# Altium schematic sheet I2C Multiplexer.SchDoc
size A3
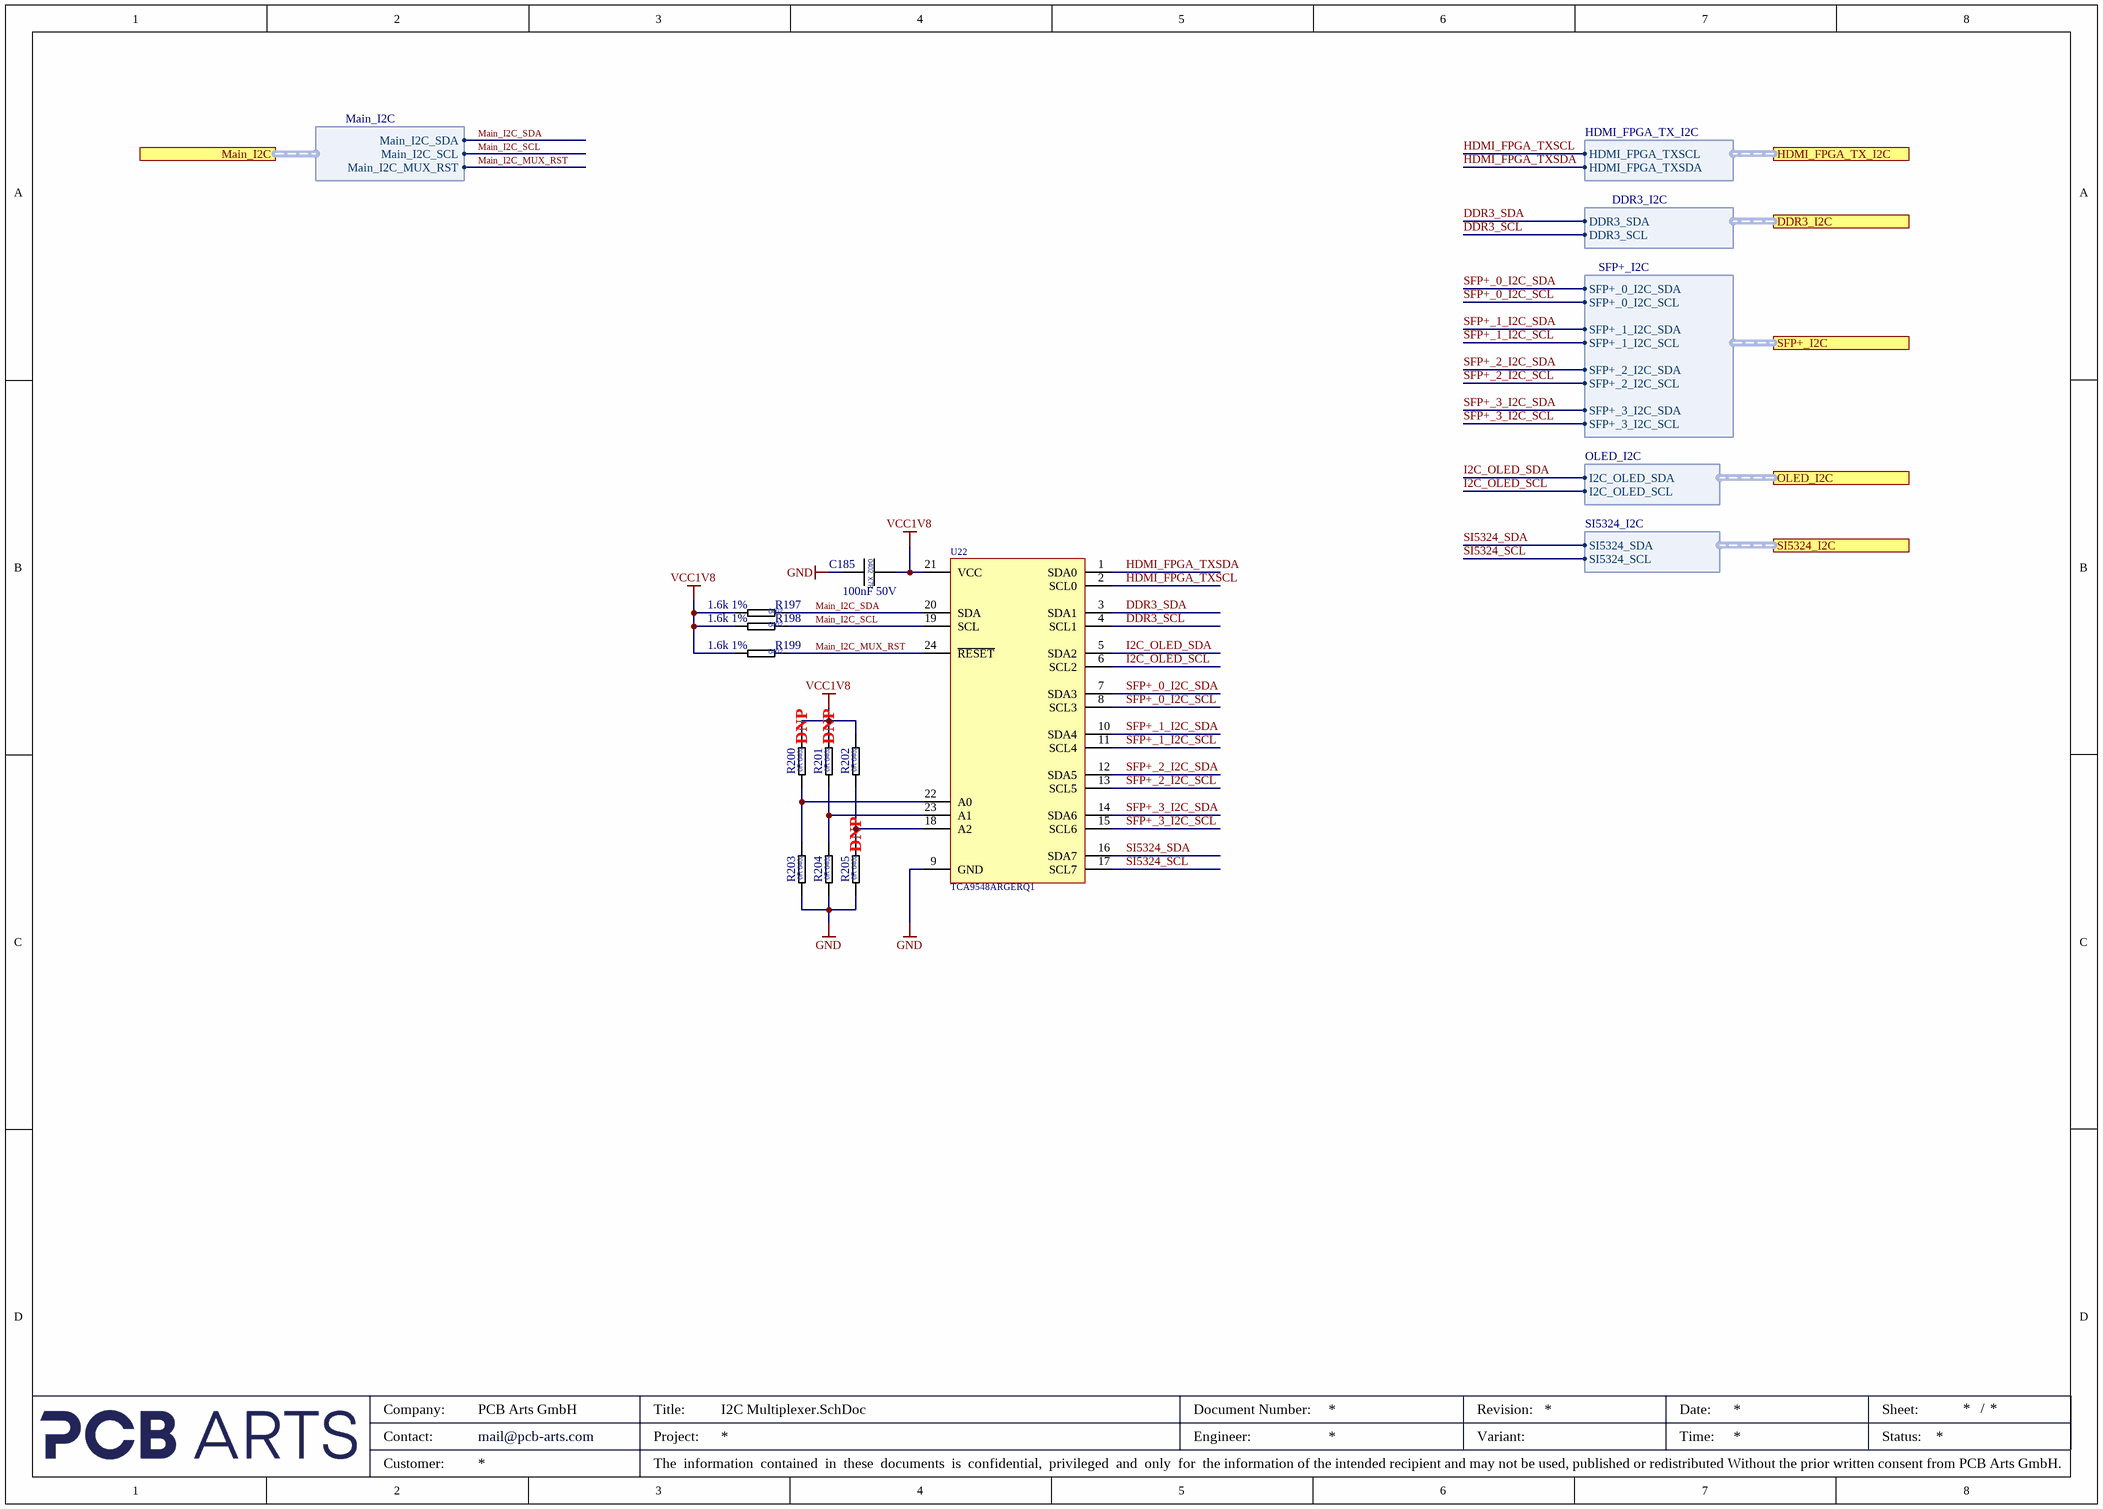
[diagram p0: I2C Multiplexer.SchDoc]

## Parts
C185  100nF 50V  [CAP_0402_L]
R197  1.6k 1%  [RES_0402_L]
R198  1.6k 1%  [RES_0402_L]
R199  1.6k 1%  [RES_0402_L]
R200  0R Jumper  [RES_0402_L]  (value not drawn)  (no BOM)
R201  0R Jumper  [RES_0402_L]  (value not drawn)  (no BOM)
R202  0R Jumper  [RES_0402_L]  (value not drawn)
R203  0R Jumper  [RES_0402_L]  (value not drawn)
R204  0R Jumper  [RES_0402_L]  (value not drawn)
R205  0R Jumper  [RES_0402_L]  (value not drawn)  (no BOM)
U22  TCA9548ARGERQ1  [QFN50P400X400X100-25N]

## Ports
DDR3_I2C (harness DDR3_I2C, see Top-Level-Sheet[6C], DDR3 Memory_SO-DIMM[8C]), HDMI_FPGA_TX_I2C (harness HDMI_FPGA_TX_I2C, see Top-Level-Sheet[6C], Bank 13_Bank 15_Bank 16[8C]), Main_I2C (harness Main_I2C, see Top-Level-Sheet[6C], SMI Bank 12[1B]), OLED_I2C (harness OLED_I2C, see Top-Level-Sheet[6C], HMI[1A]), SFP+_I2C (harness SFP+_I2C, see Top-Level-Sheet[6C], SFP+_Connectors[8B]), SI5324_I2C (harness SI5324_I2C, see Top-Level-Sheet[6C], System Clocks[1A])

## Harnesses
HDMI_FPGA_TX_I2C: HDMI_FPGA_TXSCL, HDMI_FPGA_TXSDA
DDR3_I2C: DDR3_SDA, DDR3_SCL
SFP+_I2C: SFP+_3_I2C_SDA, SFP+_3_I2C_SCL, SFP+_0_I2C_SDA, SFP+_0_I2C_SCL, SFP+_1_I2C_SDA, SFP+_1_I2C_SCL, SFP+_2_I2C_SDA, SFP+_2_I2C_SCL
OLED_I2C: I2C_OLED_SDA, I2C_OLED_SCL
Main_I2C: Main_I2C_SCL, Main_I2C_MUX_RST, Main_I2C_SDA
SI5324_I2C: SI5324_SDA, SI5324_SCL

## Nets
GND: C185.2 R203.1 R204.1 R205.1 U22.9(GND)
VCC1V8: C185.1 R197.2 R198.2 R199.2 R200.2 R201.2 R202.2 U22.21(VCC)
DDR3_SCL: U22.4(SCL1) ; port DDR3_I2C.DDR3_SCL
DDR3_SDA: U22.3(SDA1) ; port DDR3_I2C.DDR3_SDA
HDMI_FPGA_TXSCL: U22.2(SCL0) ; port HDMI_FPGA_TX_I2C.HDMI_FPGA_TXSCL
HDMI_FPGA_TXSDA: U22.1(SDA0) ; port HDMI_FPGA_TX_I2C.HDMI_FPGA_TXSDA
I2C_OLED_SCL: U22.6(SCL2) ; port OLED_I2C.I2C_OLED_SCL
I2C_OLED_SDA: U22.5(SDA2) ; port OLED_I2C.I2C_OLED_SDA
Main_I2C_MUX_RST: R199.1 U22.24(~{RESET}) ; port Main_I2C.Main_I2C_MUX_RST
Main_I2C_SCL: R198.1 U22.19(SCL) ; port Main_I2C.Main_I2C_SCL
Main_I2C_SDA: R197.1 U22.20(SDA) ; port Main_I2C.Main_I2C_SDA
SFP+_0_I2C_SCL: U22.8(SCL3) ; port SFP+_I2C.SFP+_0_I2C_SCL
SFP+_0_I2C_SDA: U22.7(SDA3) ; port SFP+_I2C.SFP+_0_I2C_SDA
SFP+_1_I2C_SCL: U22.11(SCL4) ; port SFP+_I2C.SFP+_1_I2C_SCL
SFP+_1_I2C_SDA: U22.10(SDA4) ; port SFP+_I2C.SFP+_1_I2C_SDA
SFP+_2_I2C_SCL: U22.13(SCL5) ; port SFP+_I2C.SFP+_2_I2C_SCL
SFP+_2_I2C_SDA: U22.12(SDA5) ; port SFP+_I2C.SFP+_2_I2C_SDA
SFP+_3_I2C_SCL: U22.15(SCL6) ; port SFP+_I2C.SFP+_3_I2C_SCL
SFP+_3_I2C_SDA: U22.14(SDA6) ; port SFP+_I2C.SFP+_3_I2C_SDA
SI5324_SCL: U22.17(SCL7) ; port SI5324_I2C.SI5324_SCL
SI5324_SDA: U22.16(SDA7) ; port SI5324_I2C.SI5324_SDA
NetR200_1: R200.1 R203.2 U22.22(A0)
NetR201_1: R201.1 R204.2 U22.23(A1)
NetR202_1: R202.1 R205.2 U22.18(A2)

## Notes on the sheet
- (near R200) DNP
- (near R201) DNP
- (near R205) DNP
- Company:
- Contact:
- Customer:
- mail@pcb-arts.com
- PCB Arts GmbH
- Title:
- Project:
- The  information  contained  in  these  documents  is  confidential,  privileged  and  only  for  the information of the intended recipient and may not be used, published or redistributed Without the prior written consent from PCB Arts GmbH.
- Engineer:
- Document Number:
- Revision:
- Variant:
- Date:
- Time:
- Sheet:
- Status:
- /
- (in symbol CAP_0402_100nF_50V) 0402; X7R
- (in symbol RES_0402_0R Jumper) 0R 0402
- (in symbol RES_0402_1.6k_1%) 0402

## Library data of the parts
C185 = CAP_0402_100nF_50V: Multilayer Ceramic Capacitors MLCC - SMD/SMT 0402 50VDC; Manufacturer 1: Murata Electronics; Manufacturer 1 Prt. Nr.: GCM155L8EH104KE07D; Manufacturer 2 Prt. Nr.: UMK105B7104KV-FR; Manufacturer 2: TDK
R197-R199 = RES_0402_1.6k_1%: Thick Film Resistors - SMD 1.6kOhm 1%; Manufacturer 1: Vishay / Dale; Manufacturer 1 Prt. Nr.: CRCW04021K60FKEDC; Manufacturer 2 Prt. Nr.: RC0402FR-7W1K6L; Manufacturer 2: Yageo
R200-R205 = RES_0402_0R Jumper: Thick Film Resistors - SMD 0Ohm; Manufacturer 1: Vishay / Dale; Manufacturer 1 Prt. Nr.: CRCW04020000Z0EDC; Manufacturer 2 Prt. Nr.: RC0402JR-070RL; Manufacturer 2: Yageo
U22 = TCA9548ARGERQ1_8-Channel I2C Switch with Reset: Automotive 8-Channel I2C Switch with Reset; Manufacturer 1: Texas Instruments; Manufacturer 1 Prt. Nr.: TCA9548ARGERQ1